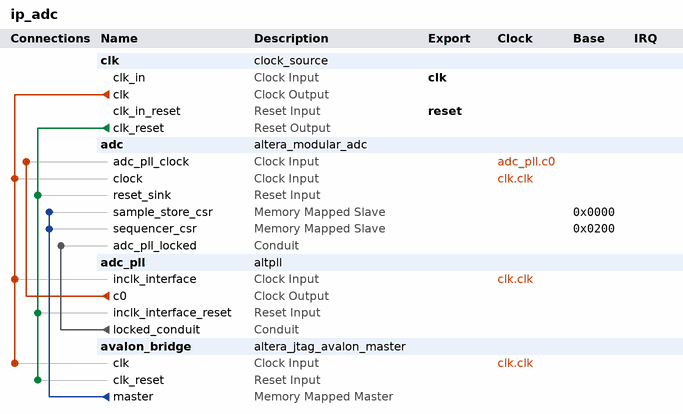
[diagram p0: system contents]
# Platform Designer (Qsys) system ip_adc, MAX 10 10M08SAE144C8GES
# Parameters at their usual value, and those the tool derives, are not listed.
package require -exact qsys 18.0
create_system ip_adc
set_project_property DEVICE_FAMILY {MAX 10}
set_project_property DEVICE 10M08SAE144C8GES

add_instance clk clock_source 18.0
set_instance_parameter_value clk clockFrequency 50000000

add_instance adc altera_modular_adc 18.0
set_instance_parameter_value adc CLOCK_FREQ 50000000
set_instance_parameter_value adc CORE_VAR 0
set_instance_parameter_value adc DEVICE_PART 10M08SAE144C8GES
set_instance_parameter_value adc clkdiv 2
set_instance_parameter_value adc int_vref_vr 3.0
set_instance_parameter_value adc refsel 0
set_instance_parameter_value adc sample_rate 0
set_instance_parameter_value adc seq_order_length 1
set_instance_parameter_value adc seq_order_slot_1 17
set_instance_parameter_value adc seq_order_slot_2 30
set_instance_parameter_value adc seq_order_slot_3 30
set_instance_parameter_value adc seq_order_slot_4 30
set_instance_parameter_value adc seq_order_slot_5 30
set_instance_parameter_value adc seq_order_slot_6 30
set_instance_parameter_value adc seq_order_slot_7 30
set_instance_parameter_value adc use_ch0 false
set_instance_parameter_value adc use_ch1 false
set_instance_parameter_value adc use_ch2 false
set_instance_parameter_value adc use_ch3 false
set_instance_parameter_value adc use_ch4 false
set_instance_parameter_value adc use_ch5 false
set_instance_parameter_value adc use_ch6 false
set_instance_parameter_value adc use_ch7 false
set_instance_parameter_value adc use_ch8 false
set_instance_parameter_value adc use_tsd true

add_instance adc_pll altpll 18.0
set_instance_parameter_value adc_pll CLK0_DIVIDE_BY 5
set_instance_parameter_value adc_pll CLK0_MULTIPLY_BY 1
set_instance_parameter_value adc_pll INCLK0_INPUT_FREQUENCY 20000
set_instance_parameter_value adc_pll PORT_ARESET PORT_UNUSED
set_instance_parameter_value adc_pll PORT_LOCKED PORT_USED
set_instance_parameter_value adc_pll PORT_clk1 PORT_UNUSED
set_instance_parameter_value adc_pll PORT_clk2 PORT_UNUSED
set_instance_parameter_value adc_pll PORT_clk3 PORT_UNUSED

add_instance avalon_bridge altera_jtag_avalon_master 18.0

# connections
add_connection adc_pll.c0 adc.adc_pll_clock clock
add_connection clk.clk adc.clock clock
add_connection clk.clk adc_pll.inclk_interface clock
add_connection clk.clk avalon_bridge.clk clock
add_connection clk.clk_reset adc.reset_sink reset
add_connection clk.clk_reset adc_pll.inclk_interface_reset reset
add_connection clk.clk_reset avalon_bridge.clk_reset reset
add_connection avalon_bridge.master adc.sample_store_csr avalon
set_connection_parameter_value avalon_bridge.master/adc.sample_store_csr baseAddress 0x0000
add_connection avalon_bridge.master adc.sequencer_csr avalon
set_connection_parameter_value avalon_bridge.master/adc.sequencer_csr baseAddress 0x0200
add_connection adc_pll.locked_conduit adc.adc_pll_locked conduit

# exported interfaces
add_interface clk clock sink
set_interface_property clk EXPORT_OF clk.clk_in
add_interface reset reset sink
set_interface_property reset EXPORT_OF clk.clk_in_reset

set_interconnect_requirement {$system} qsys_mm.clockCrossingAdapter HANDSHAKE
set_interconnect_requirement {$system} qsys_mm.enableEccProtection FALSE
set_interconnect_requirement {$system} qsys_mm.insertDefaultSlave FALSE
set_interconnect_requirement {$system} qsys_mm.maxAdditionalLatency 1

save_system ip_adc.qsys
